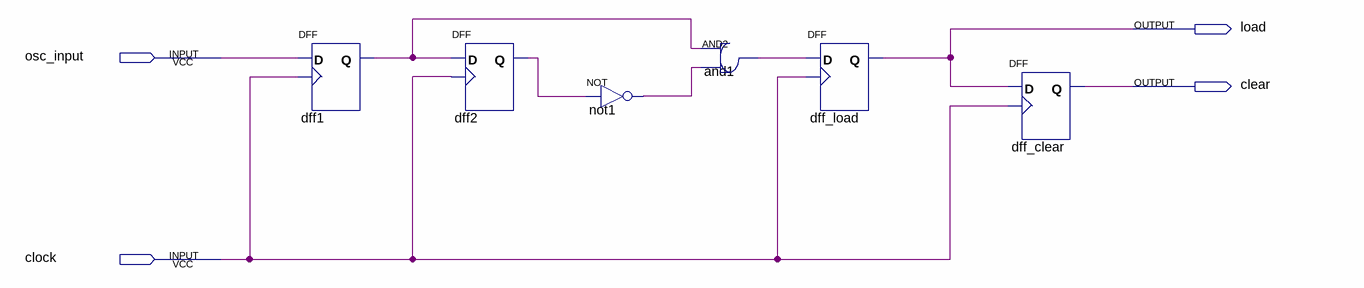
[diagram p0: schematic sheet]
// Quartus schematic UnidadeControle.bdf as structural Verilog: 6 symbols, 4 pins
module UnidadeControle (
  input  osc_input,
  input  clock,
  output load,
  output clear
);

  wire and1_out, dff1_q, dff2_q, not1_out;

  DFF dff1 (.CLK(clock), .D(osc_input), .Q(dff1_q));
  DFF dff2 (.CLK(clock), .D(dff1_q), .Q(dff2_q));
  not not1 (not1_out, dff2_q);
  and and1 (and1_out, dff1_q, not1_out);
  DFF dff_load (.CLK(clock), .D(and1_out), .Q(load));
  DFF dff_clear (.CLK(clock), .D(load), .Q(clear));
endmodule
